# Altium project 毕业设计.PrjPcb
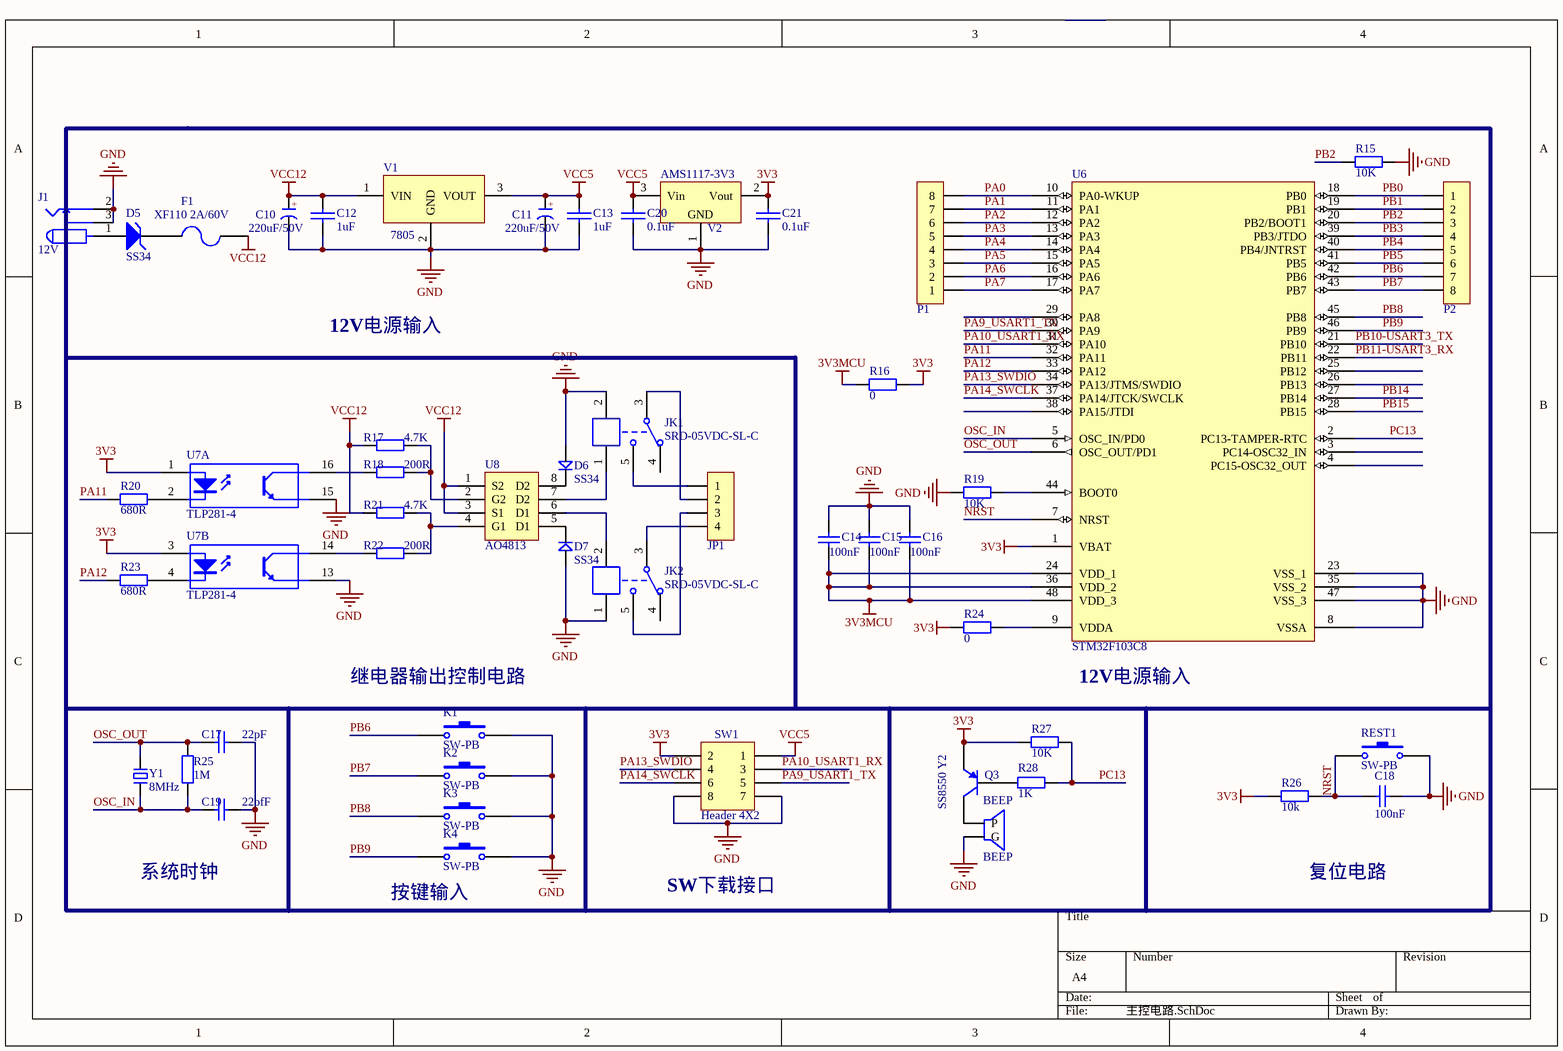
[diagram p0: 主控电路.SchDoc]
2 sheets, 99 parts. Net scope: global (net labels, ports and power ports of the same name join across sheets).
Board file: PCB电路板.PcbDoc
Sheets:
  主控电路.SchDoc
  GPRS通信.SchDoc

## Sheet 主控电路.SchDoc
size A4

### Parts
BEEP  BEEP  [BUZZER]
C10  220uF/50V  [CAP 3.5*8*11.5 - BK]
C11  220uF/50V  [CAP 3.5*8*11.5 - BK]
C12  1uF  [LC-0603_C]
C13  1uF  [LC-0603_C]
C14  100nF  [LC-0603_C]
C15  100nF  [LC-0603_C]
C16  100nF  [LC-0603_C]
C17  22pF  [LC-0603_C]
C18  100nF  [LC-0603_C]
C19  22pfF  [LC-0603_C]
C20  0.1uF  [LC-0603_C]
C21  0.1uF  [LC-0603_C]
D5  SS34  [D1812]
D6  SS34  [D1812]
D7  SS34  [D1812]
F1  XF110 2A/60V  [FUSE1]
J1  12V  [DC10B]
JK1  SRD-05VDC-SL-C  [SRD-C_B]
JK2  SRD-05VDC-SL-C  [SRD-C_B]
JP1  HDR-1X4  [KF128-5.08-4P]  (value not drawn)
K1  SW-PB  [TSW DIP-6*6*5]
K2  SW-PB  [TSW DIP-6*6*5]
K3  SW-PB  [TSW DIP-6*6*5]
K4  SW-PB  [TSW DIP-6*6*5]
P1  HDR-1X8  [HDR2.54-LI-8P]  (value not drawn)
P2  HDR-1X8  [HDR2.54-LI-8P]  (value not drawn)
Q3  SS8550 Y2  [LC-SOT-23(SOT-23-3)]
R15  10K  [LC-0603_R]
R16  0  [LC-0603_R]
R17  4.7K  [LC-0603_R]
R18  200R  [LC-0603_R]
R19  10K  [LC-0603_R]
R20  680R  [LC-0603_R]
R21  4.7K  [LC-0603_R]
R22  200R  [LC-0603_R]
R23  680R  [LC-0603_R]
R24  0  [LC-0603_R]
R25  1M  [LC-0603_R]
R26  10k  [LC-0603_R]
R27  10K  [LC-0603_R]
R28  1K  [LC-0603_R]
REST1  SW-PB  [TSW DIP-6*6*5]
SW1  Header 4X2  [HDR2.54-LI-2x4P]
U6  STM32F103C8  [LQFP48 7X7_M]
U7  TLP281-4  [SOp-16]  (parts A,B of 4)
U8  AO4813  [SOP-8]
V1  7805  [TO220A]
V2  AMS1117-3V3  [SOT223_M]
Y1  8MHz  [OSC HC-49S]

### Nets
3V3: C21.2 Q3.2(E) R16.1 R24.2 R26.1 R27.2 SW1.2 U6.1(VBAT) U7.1(A) U7.3(A) V2.2(Vout)
3V3MCU: C14.1 C15.1 C16.1 R16.2 U6.24(VDD_1) U6.36(VDD_2) U6.48(VDD_3)
GND: BEEP.2(G) C10.2(K) C11.2(K) C12.1 C13.1 C14.2 C15.2 C16.2 C17.2 C18.2 C19.2 C20.1 C21.1 D6.1 D7.1 J1.2 J1.3 JK1.2 JK2.1 K1.2 K2.2 K3.2 K4.2 R15.2 R19.2 REST1.2 SW1.7 SW1.8 U6.8(VSSA) U6.23(VSS_1) U6.35(VSS_2) U6.47(VSS_3) U7.13(E) U7.15(E) V1.2(GND) V2.1(GND)
VCC5: C11.1(A) C13.2 C20.2 SW1.1 V1.3(VOUT) V2.3(Vin)
VCC12: C10.1(A) C12.2 F1.2 R17.2 R21.2 U8.1(S2) U8.3(S1) V1.1(VIN)
NRST: C18.1 R26.2 REST1.1 U6.7(NRST)
OSC_IN: C19.1 R25.1 U6.5(OSC_IN/PD0) Y1.1
OSC_OUT: C17.1 R25.2 U6.6(OSC_OUT/PD1) Y1.2
PA0: P1.8 U6.10(PA0-WKUP)
PA1: P1.7 U6.11(PA1)
PA2: P1.6 U6.12(PA2)
PA3: P1.5 U6.13(PA3)
PA4: P1.4 U6.14(PA4)
PA5: P1.3 U6.15(PA5)
PA6: P1.2 U6.16(PA6)
PA7: P1.1 U6.17(PA7)
PA9_USART1_TX: SW1.5 U6.30(PA9)
PA10_USART1_RX: SW1.3 U6.31(PA10)
PA11: R20.1 U6.32(PA11)
PA12: R23.1 U6.33(PA12)
PA13_SWDIO: SW1.4 U6.34(PA13/JTMS/SWDIO)
PA14_SWCLK: SW1.6 U6.37(PA14/JTCK/SWCLK)
PB0: P2.1 U6.18(PB0)  [project net CLK]
PB1: P2.2 U6.19(PB1)  [project net DIN]
PB2: P2.3 R15.1 U6.20(PB2/BOOT1)  [project net DC]
PB3: P2.4 U6.39(PB3/JTDO)  [project net CE]
PB4: P2.5 U6.40(PB4/JNTRST)
PB5: P2.6 U6.41(PB5)
PB6: K1.1 P2.7 U6.42(PB6)
PB7: K2.1 P2.8 U6.43(PB7)
PB8: K3.1 U6.45(PB8)
PB9: K4.1 U6.46(PB9)
PB10-USART3_TX: U6.21(PB10)
PB11-USART3_RX: U6.22(PB11)
PB14: U6.27(PB14)
PB15: U6.28(PB15)
PC13: R27.1 R28.1 U6.2(PC13-TAMPER-RTC)
NetBEEP_1: BEEP.1(P) Q3.3(C)
NetD5_1: D5.1(A) J1.1
NetD5_2: D5.2(K) F1.1
NetD6_2: D6.2 U8.8(D2)
NetD7_2: D7.2 U8.5(D1)
NetJK1_1: JK1.1 U8.7(D2)
NetJK1_3: JK1.3 JP1.2
NetJK1_5: JK1.5 JP1.1
NetJK2_2: JK2.2 U8.6(D1)
NetJK2_3: JK2.3 JP1.4
NetJK2_5: JK2.5 JP1.3
NetQ3_1: Q3.1(B) R28.2
NetR17_1: R17.1 R18.2 U8.2(G2)
NetR18_1: R18.1 U7.16(C)
NetR19_1: R19.1 U6.44(BOOT0)
NetR20_2: R20.2 U7.2(K)
NetR21_1: R21.1 R22.2 U8.4(G1)
NetR22_1: R22.1 U7.14(C)
NetR23_2: R23.2 U7.4(K)
NetR24_1: R24.1 U6.9(VDDA)

Not connected (* = marked no-connect by the designer): JK1 4; JK2 4; U6 3(PC14-OSC32_IN) 4(PC15-OSC32_OUT) 25(PB12) 26(PB13) 29(PA8) 38(PA15/JTDI)

### Notes on the sheet
- 12V电源输入
- (near K1) 继电器输出控制电路
- 系统时钟
- (near K4) 按键输入
- SW下载接口
- 复位电路
- (in symbol C-CAP) +

### Library data of the parts
C10 C11 = C-CAP: 直插电解电容; 版权归属: 源创客; BOM名称: 直插电解电容; 学习资源: www.ooocke.com
C12 C13 C20 C21 = 0805C: Capacitor 0805
C14-C19 = Cap: 无极性电容; Published: 8-Jun-2000; LatestRevisionDate: 17-Jul-2002; LatestRevisionNote: Re-released for DXP Platform.; PackageReference: RAD-0.3; Publisher: Altium Limited
D5 = 1N5822: Zener Diode
D6 D7 = D
F1 = FUSE2: Fuse
J1 = POW
JK1 JK2 = SRD-05VDC-SL-C: 5V一组转换; BOM名称: 5V继电器; 版权归属: 源创客; 学习资源: www.ooocke.com
JP1 = Header 4: 4P接插件; 版权归属: 源创客; BOM名称: 4P接插件; 学习资源: www.ooocke.com
K1-K4 REST1 = SW-PB: Switch; Published: 24-Mar-1999; LatestRevisionDate: 17-Jul-2002; LatestRevisionNote: Re-released for DXP Platform.; PackageReference: SPST-2; Publisher: Altium Limited; PackageDescription: Switch; 2 Leads
P1 P2 = Header 8: 8P接插件; 版权归属: 源创客; BOM名称: 8P接插件; 学习资源: www.ooocke.com
Q3 = SOT-23 SS8550 Y2: 三极管; ComponentLink1Description: 供应商链接; ComponentLink1URL: http://www.szlcsc.com/product/details_9037.html; Package: SOT-23; Supplier: LC; SuppliersPartNumber: C8542
R15 R16 R19 R24-R26 = Res1: 贴片电阻; Value: 1K; Published: 8-Jun-2000; LatestRevisionDate: 17-Jul-2002; LatestRevisionNote: Re-released for DXP Platform.; PackageReference: AXIAL-0.4; Publisher: Altium Limited
R17 R18 R20-R23 = 0603 2.7KΩ (2701) 1%: 贴片电阻; ComponentLink1Description: 供应商链接; ComponentLink1URL: http://www.szlcsc.com/product/details_13814.html; Package: 0603; Supplier: LC; SuppliersPartNumber: C13167
R27 R28 = 0603 1.1KΩ (1101) 1%: 贴片电阻; ComponentLink1Description: 供应商链接; ComponentLink1URL: http://www.szlcsc.com/product/details_23491.html; Package: 0603; Supplier: LC; SuppliersPartNumber: C22764
SW1 = Header 4X2: Header, 4-Pin, Dual row; LatestRevisionDate: 17-Jul-2002; LatestRevisionNote: Re-released for DXP Platform.; Publisher: Altium Limited
U6 = STM32F103C8: Flaah:64/RAM:20/IO:36; BOM名称: 32位STM单片机; 版权归属: 源创客; 学习资源: www.ooocke.com
U7 = TP521-4_1
U8 = NDS8434
V1 = 78xx: 线性稳压芯片; 版权归属: 源创客; BOM名称: 线性稳压芯片; 学习资源: www.ooocke.com
V2 = AMS1117: 三端稳压芯片; BOM名称: 稳压芯片; 版权归属: 源创客; 学习资源: www.ooocke.com
Y1 = XTAL-2P: 2脚无源脚晶振; 版权归属: 源创客; BOM名称: 2脚无源脚晶振; 学习资源: www.ooocke.com

## Sheet GPRS通信.SchDoc
size A3
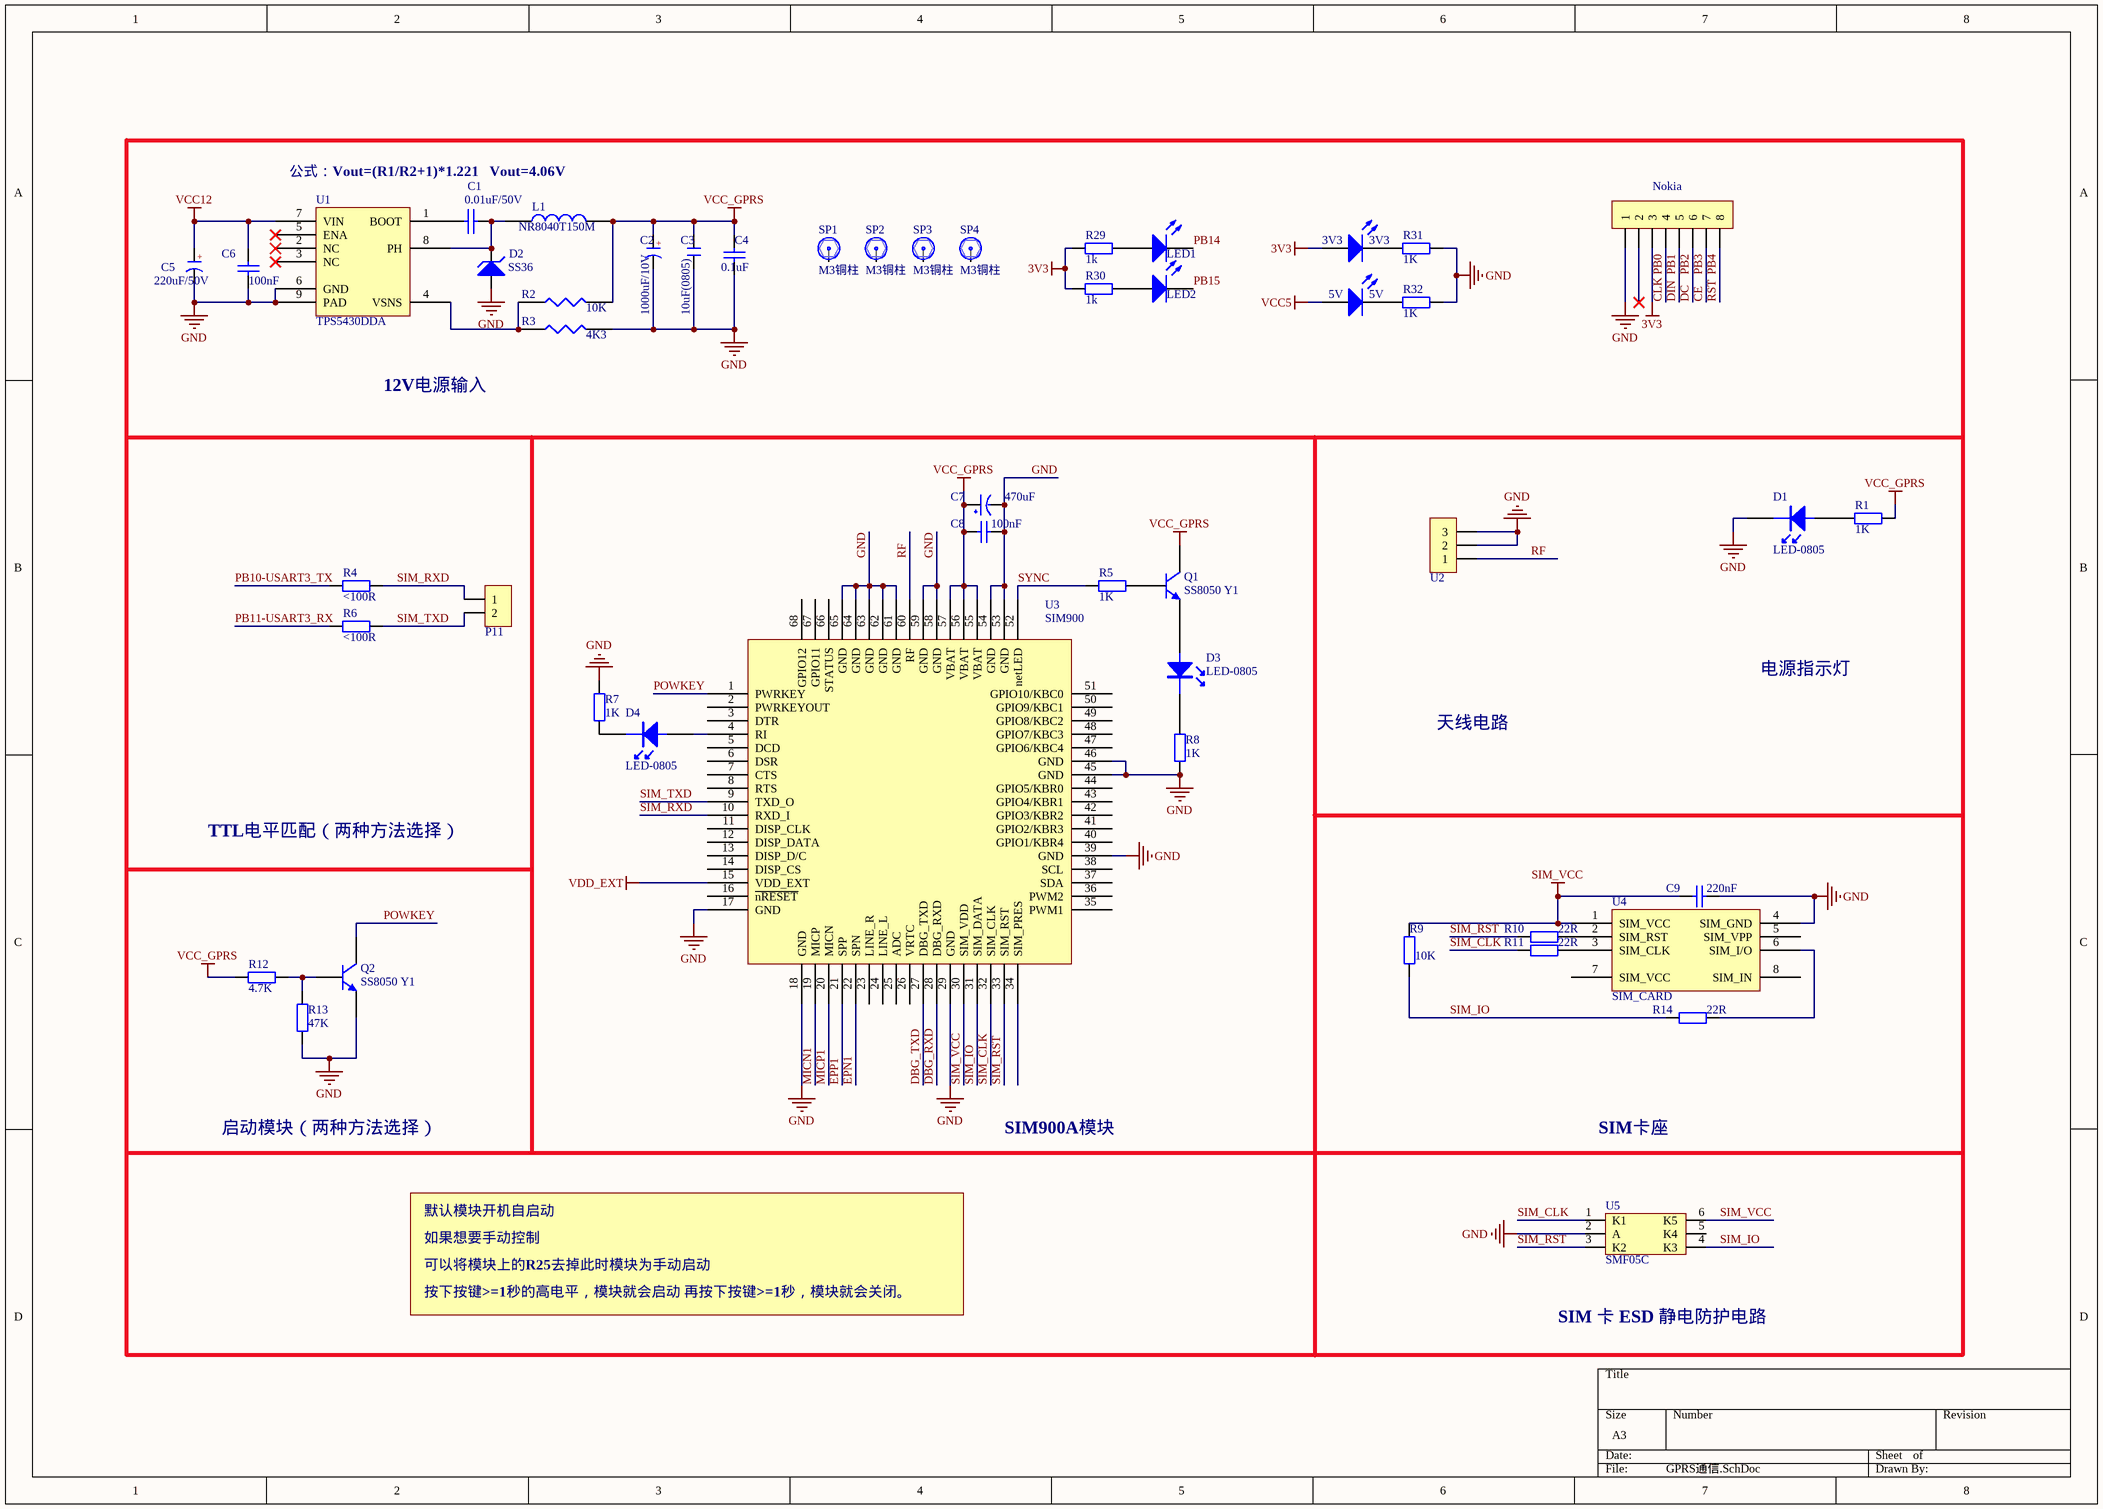
[diagram p1: GPRS通信.SchDoc]

### Parts
3V3  3V3  [LED 0805G]
5V  5V  [LED 0805G]
C1  0.01uF/50V  [LC-0603_C]
C2  1000uF/10V  [CAP 5.0*10*20 - BK]
C3  10uF(0805)  [C 0805_L]
C4  0.1uF  [LC-0603_C]
C5  220uF/50V  [CAP 3.5*8*11.5 - BK]
C6  100nF  [LC-0603_C]
C7  470uF  [CM E(8*10.2)]
C8  100nF  [LC-0603_C]
C9  220nF  [LC-0603_C]
D1  LED-0805  [LED 0805G]
D2  SS36  [D1812]
D3  LED-0805  [LED 0805G]
D4  LED-0805  [LED 0805G]
L1  NR8040T150M  [NR8040]
LED1  (no value)  [LED 0805G]
LED2  (no value)  [LED 0805G]
Nokia  HDR-1X8  [HDR2.54-M-LI-8P]  (value not drawn)
P11  HDR-1X2  [HDR2.54-LI-2P]  (value not drawn)
Q1  SS8050 Y1  [LC-SOT-23(SOT-23-3)]
Q2  SS8050 Y1  [LC-SOT-23(SOT-23-3)]
R1  1K  [LC-0603_R]
R2  10K  [LC-0603_R]
R3  4K3  [LC-0603_R]
R4  <100R  [LC-0603_R]
R5  1K  [LC-0603_R]
R6  <100R  [LC-0603_R]
R7  1K  [LC-0603_R]
R8  1K  [LC-0603_R]
R9  10K  [LC-0603_R]
R10  22R  [LC-0603_R]
R11  22R  [LC-0603_R]
R12  4.7K  [LC-0603_R]
R13  47K  [LC-0603_R]
R14  22R  [LC-0603_R]
R29  1k  [LC-0603_R]
R30  1k  [LC-0603_R]
R31  1K  [LC-0603_R]
R32  1K  [LC-0603_R]
SP1  M3铜柱  [M3x10+6_N]
SP2  M3铜柱  [M3x10+6_N]
SP3  M3铜柱  [M3x10+6_N]
SP4  M3铜柱  [M3x10+6_N]
U1  TPS5430DDA  [SO-G8]
U2  HDR-1X3  [SMA-KE-LI]  (value not drawn)
U3  SIM900  [GSM_900A]
U4  SIM_CARD  [MICRO SIM6]
U5  SMF05C  [SOT-363]

### Nets
3V3: 3V3.1(A) Nokia.3 R29.1 R30.1
GND: C2.2(K) C3.1 C4.1 C5.2(K) C6.2 C7.2(GND) C8.2 C9.2 D1.1(-) D2.1(A) Nokia.1 Q2.2(E) R3.2 R7.2 R8.2 R13.1 R31.1 R32.1 U1.6(GND) U1.9(PAD) U2.2 U2.3 U3.17(GND) U3.18(GND) U3.29(GND) U3.39(GND) U3.45(GND) U3.46(GND) U3.53(GND) U3.54(GND) U3.58(GND) U3.59(GND) U3.61(GND) U3.62(GND) U3.63(GND) U3.64(GND) U3.65(GND) U4.4(SIM_GND) U5.2(A)
SIM_VCC: C9.1 R9.2 U3.30(SIM_VDD) U4.1(SIM_VCC) U5.6(K5)
VCC5: 5V.1(A)
VCC12: C5.1(A) C6.1 U1.7(VIN)
VCC_GPRS: C2.1(A) C3.2 C4.2 C7.1(VCC) C8.1 L1.2 Q1.3(C) R1.1 R2.2 R12.1 U3.55(VBAT) U3.56(VBAT) U3.57(VBAT)
VDD_EXT: U3.15(VDD_EXT)
CE: Nokia.7  [also labelled PB3]
CLK: Nokia.4  [also labelled PB0]
DBG_RXD: U3.28(DBG_RXD)
DBG_TXD: U3.27(DBG_TXD)
DC: Nokia.6  [also labelled PB2]
DIN: Nokia.5  [also labelled PB1]
EPN1: U3.22(SPN)
EPP1: U3.21(SPP)
MICN1: U3.19(MICP)
MICP1: U3.20(MICN)
PB4: Nokia.8  [also labelled RST]
PB10-USART3_TX: R4.1
PB11-USART3_RX: R6.1
PB14: LED1.2(K)
PB15: LED2.2(K)
POWKEY: Q2.3(C) U3.1(PWRKEY)
RF: U2.1 U3.60(RF)
SIM_CLK: R11.2 U3.32(SIM_CLK) U5.1(K1)
SIM_IO: R9.1 R14.2 U3.31(SIM_DATA) U5.4(K3)
SIM_RST: R10.2 U3.33(SIM_RST) U5.3(K2)
SIM_RXD: P11.1 R4.2 U3.10(RXD_I)
SIM_TXD: P11.2 R6.2 U3.9(TXD_O)
SYNC: R5.2 U3.52(netLED)
Net3V3_2: 3V3.2(K) R31.2
Net5V_2: 5V.2(K) R32.2
NetC1_1: C1.1 U1.1(BOOT)
NetC1_2: C1.2 D2.2(K) L1.1 U1.8(PH)
NetD1_2: D1.2(+) R1.2
NetD3_1: D3.1(-) R8.1
NetD3_2: D3.2(+) Q1.2(E)
NetD4_1: D4.1(-) R7.1
NetD4_2: D4.2(+) U3.4(RI)
NetLED1_1: LED1.1(A) R29.2
NetLED2_1: LED2.1(A) R30.2
NetQ1_1: Q1.1(B) R5.1
NetQ2_1: Q2.1(B) R12.2 R13.2
NetR2_1: R2.1 R3.1 U1.4(VSNS)
NetR10_1: R10.1 U4.2(SIM_RST)
NetR11_1: R11.1 U4.3(SIM_CLK)
NetR14_1: R14.1 U4.6(SIM_I/O)

Not connected (* = marked no-connect by the designer): Nokia 2*; SP1 1; SP2 1; SP3 1; SP4 1; U1 2(NC)* 3(NC)* 5(ENA)*; U3 2(PWRKEYOUT) 3(DTR) 5(DCD) 6(DSR) 7(CTS) 8(RTS) 11(DISP_CLK) 12(DISP_DATA) 13(DISP_D/C) 14(DISP_CS) 16(~{nRESET}) 23(LINE_R) 24(LINE_L) 25(ADC) 26(VRTC) 34(SIM_PRES) 35(PWM1) 36(PWM2) 37(SDA) 38(SCL) 40(GPIO1/KBR4) 41(GPIO2/KBR3) 42(GPIO3/KBR2) 43(GPIO4/KBR1) 44(GPIO5/KBR0) 47(GPIO6/KBC4) 48(GPIO7/KBC3) 49(GPIO8/KBC2) 50(GPIO9/KBC1) 51(GPIO10/KBC0) 66(STATUS) 67(GPIO11) 68(GPIO12); U4 5(SIM_VPP) 7(SIM_VCC) 8(SIM_IN); U5 5(K4)

### Notes on the sheet
- 公式：Vout=(R1/R2+1)*1.221   Vout=4.06V
- 12V电源输入
- 电源指示灯
- 天线电路
- TTL电平匹配（两种方法选择）
- 启动模块（两种方法选择）
- SIM900A模块
- SIM卡座
- 默认模块开机自启动
- 如果想要手动控制
- 可以将模块上的R25去掉此时模块为手动启动
- 按下按键>=1秒的高电平，模块就会启动 再按下按键>=1秒，模块就会关闭。
- SIM 卡 ESD 静电防护电路
- (in symbol C-CAP) +

### Library data of the parts
3V3 5V LED1 LED2 = LED0: Typical INFRARED GaAs LED; Published: 8-Jun-2000; LatestRevisionDate: 08-Jul-2005; LatestRevisionNote: Mech Layer 1 removed.; PackageReference: LED-0; Publisher: Altium Limited
C1 = CAP: Capacitor
C2 C5 = C-CAP: 直插电解电容; 版权归属: 源创客; BOM名称: 直插电解电容; 学习资源: www.ooocke.com
C3 = C: 无极性贴片电容; 版权归属: 源创客; BOM名称: 无极性贴片电容; 学习资源: www.ooocke.com
C4 = 0603 1.0pF (010) 0.25pF 50V: 贴片电容; ComponentLink1Description: 供应商链接; ComponentLink1URL: http://www.szlcsc.com/product/details_24709.html; Package: 0603; Supplier: LC; SuppliersPartNumber: C23969
C6 C8 C9 = 0603 1uF (105) 10% 50V: 贴片电容; ComponentLink1Description: 供应商链接; ComponentLink1URL: http://www.szlcsc.com/product/details_16531.html; Package: 0603; Supplier: LC; SuppliersPartNumber: C15849
C7 = CAP
D1 D3 D4 = LED_SMD: 贴片LED
D2 = SS36: Zener Diode
L1 = INDUCTOR
Nokia = Header 8: 8P接插件; 版权归属: 源创客; BOM名称: 8P接插件; 学习资源: www.ooocke.com
P11 = Header 2: 2P接插件; 版权归属: 源创客; BOM名称: 2P接插件; 学习资源: www.ooocke.com
Q1 Q2 = SOT-23 SS8050 Y1: 三极管; ComponentLink1Description: 供应商链接; ComponentLink1URL: http://www.szlcsc.com/product/details_2507.html; Package: SOT-23; Supplier: LC; SuppliersPartNumber: C2150
R1 R4-R14 = 0603 2KΩ (2001) 1%: 贴片电阻; ComponentLink1Description: 供应商链接; ComponentLink1URL: http://www.szlcsc.com/product/details_23702.html; Package: 0603; Supplier: LC; SuppliersPartNumber: C22975
R2 R3 = RES1
R29 R30 = Res1: 贴片电阻; Published: 8-Jun-2000; LatestRevisionDate: 17-Jul-2002; LatestRevisionNote: Re-released for DXP Platform.; PackageReference: AXIAL-0.4; Publisher: Altium Limited; Value: 1K
R31 R32 = 0603 1.1KΩ (1101) 1%: 贴片电阻; ComponentLink1Description: 供应商链接; ComponentLink1URL: http://www.szlcsc.com/product/details_23491.html; Package: 0603; Supplier: LC; SuppliersPartNumber: C22764
SP1-SP4 = 铜柱加头大焊盘: 铜柱; 版权归属: 源创客; BOM名称: 铜柱; 学习资源: www.ooocke.com
U2 = Header 3: 3P接插件; 版权归属: 源创客; BOM名称: 3P接插件; 学习资源: www.ooocke.com
U4 = SIM_CARD: SIM中卡卡槽
U5 = SMF05C: TVS

## Nets that join several sheets
3V3: 主控电路 (11 pins), GPRS通信 (3V3.1 Nokia.3 R29.1 R30.1)
GND: 主控电路 (36 pins), GPRS通信 (39 pins)
VCC5: 主控电路 (6 pins), GPRS通信 (5V.1)
VCC12: 主控电路 (8 pins), GPRS通信 (C5.1 C6.1 U1.7)
CE: 主控电路 (P2.4 U6.39), GPRS通信 (Nokia.7)
CLK: 主控电路 (P2.1 U6.18), GPRS通信 (Nokia.4)
DC: 主控电路 (P2.3 R15.1 U6.20), GPRS通信 (Nokia.6)
DIN: 主控电路 (P2.2 U6.19), GPRS通信 (Nokia.5)
PB4: 主控电路 (P2.5 U6.40), GPRS通信 (Nokia.8)
PB10-USART3_TX: 主控电路 (U6.21), GPRS通信 (R4.1)
PB11-USART3_RX: 主控电路 (U6.22), GPRS通信 (R6.1)
PB14: 主控电路 (U6.27), GPRS通信 (LED1.2)
PB15: 主控电路 (U6.28), GPRS通信 (LED2.2)